# Altium schematic sheet Input protect power.SchDoc
size A4
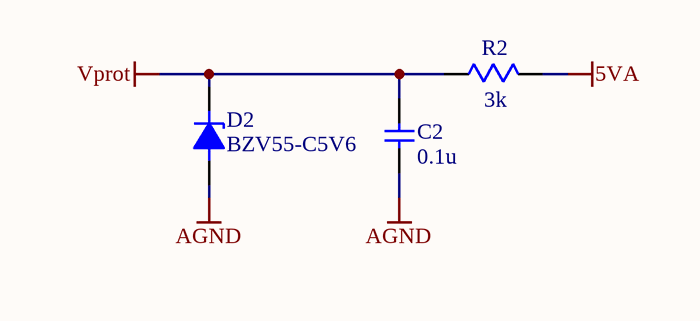
[diagram p0: Input protect power.SchDoc]

## Parts
C2  0.1u  [SMD/C/0603]
D2  BZV55-C5V6  [SMD/SOD-80C]
R2  3k  [SMD/R/0603]

## Nets
5VA: R2.2
AGND: C2.1 D2.A
Vprot: C2.2 D2.C R2.1

## Library data of the parts
C2 = Capacitor: Value: 0.1u
D2 = Stabilitron: Value: BZV55-C5V6
R2 = Resistor: Value: 3k